# Altium schematic sheet MCU.SchDoc
size A4; SheetNumber: 3; SheetTotal: 6
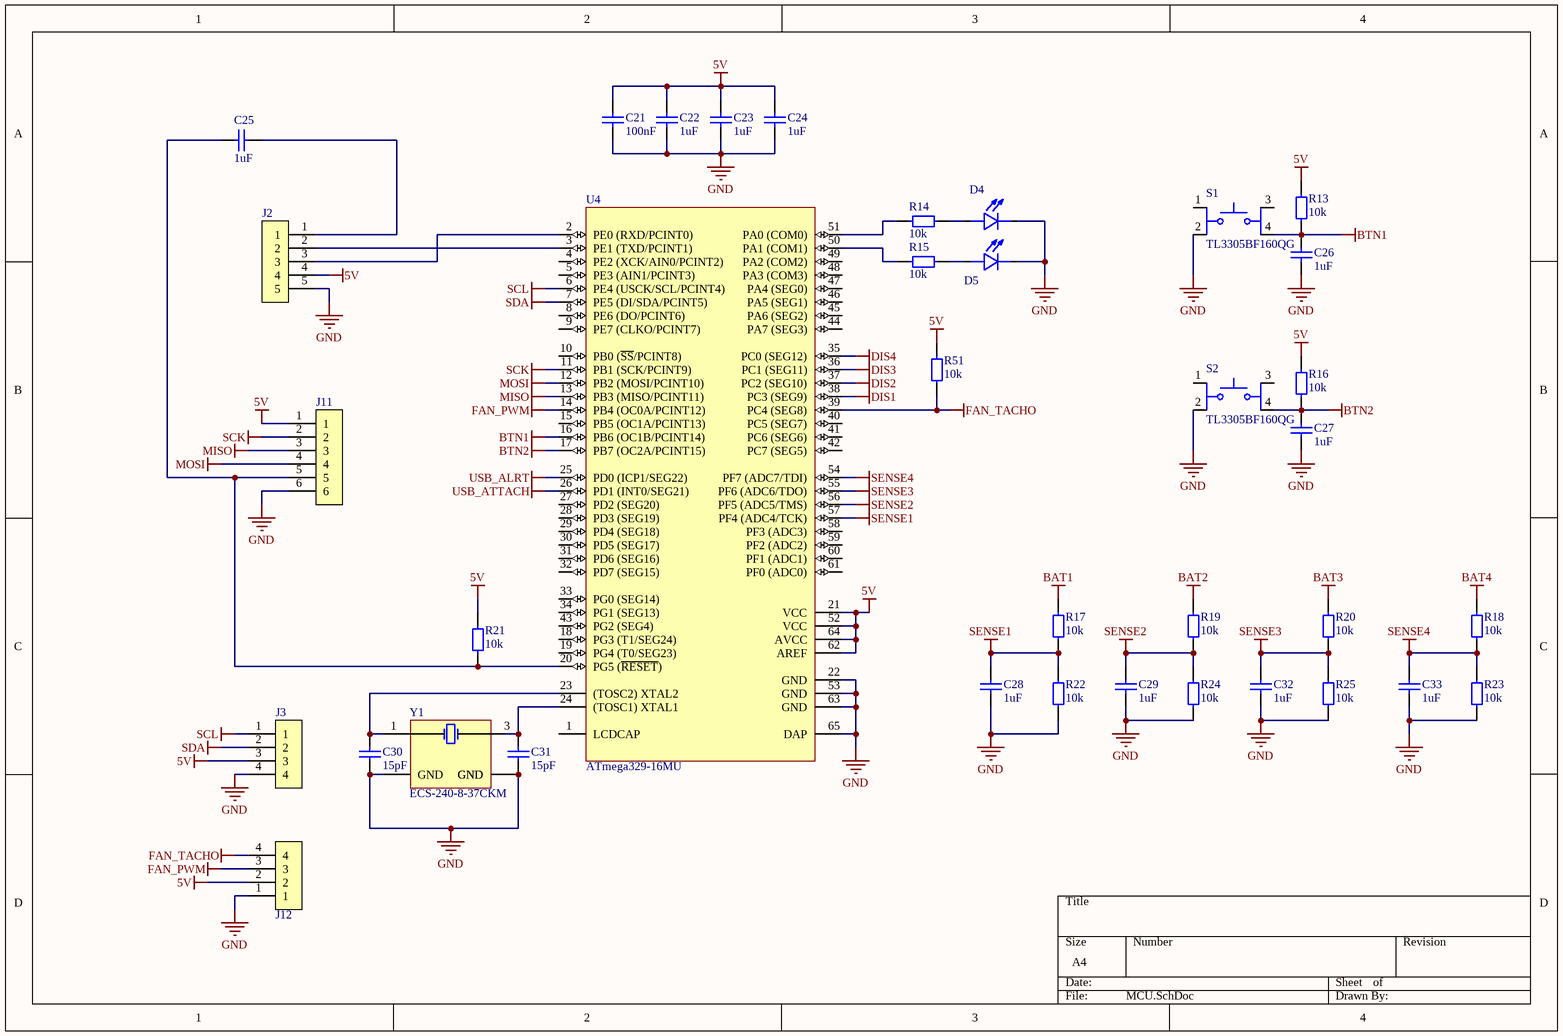
[diagram p0: MCU.SchDoc]

## Parts
C21  100nF  [0603 Capacitor]
C22  1uF  [0603 Capacitor]
C23  1uF  [0603 Capacitor]
C24  1uF  [0603 Capacitor]
C25  1uF  [0603 Capacitor]
C26  1uF  [0603 Capacitor]
C27  1uF  [0603 Capacitor]
C28  1uF  [0603 Capacitor]
C29  1uF  [0603 Capacitor]
C30  15pF  [0603 Capacitor]
C31  15pF  [0603 Capacitor]
C32  1uF  [0603 Capacitor]
C33  1uF  [0603 Capacitor]
D4  LTST-C190KGKT  [LED 0603]  (value not drawn)
D5  LTST-C190KGKT  [LED 0603]  (value not drawn)
J2  5-534237-3  [5pin header]  (value not drawn)
J3  MTSW-104-07-G-S-000  [HDRV4W64P0X254_1X4_1016X254X864P]  (value not drawn)
J11  MTSW-106-07-L-S-210  [SAMTEC_MTSW-106-23-L-S-240]  (value not drawn)
J12  MTSW-104-07-G-S-000  [HDRV4W64P0X254_1X4_1016X254X864P]  (value not drawn)
R13  10k  [0603 Resistor]
R14  10k  [0603 Resistor]
R15  10k  [0603 Resistor]
R16  10k  [0603 Resistor]
R17  10k  [0603 Resistor]
R18  10k  [0603 Resistor]
R19  10k  [0603 Resistor]
R20  10k  [0603 Resistor]
R21  10k  [0603 Resistor]
R22  10k  [0603 Resistor]
R23  10k  [0603 Resistor]
R24  10k  [0603 Resistor]
R25  10k  [0603 Resistor]
R51  10k  [0603 Resistor]
S1  TL3305BF160QG  [SW_TL3305BF160QG]
S2  TL3305BF160QG  [SW_TL3305BF160QG]
U4  ATmega329-16MU  [ATmega329]
Y1  ECS-240-8-37CKM  [XTAL_ECS-240-8-37CKM]

## Nets
5V: C21.2 C22.2 C23.2 C24.2 J2.4 J3.3 J11.1 J12.2 R13.1(CCW) R16.1(CCW) R21.1(CCW) R51.2(CW) U4.21(VCC) U4.52(VCC) U4.62(AREF) U4.64(AVCC)
BAT1: R17.1(CCW)
BAT2: R19.1(CCW)
BAT3: R20.1(CCW)
BAT4: R18.1(CCW)
BTN1: C26.2 R13.2(CW) S1.4 U4.16(PB6_(OC1B/PCINT14))
BTN2: C27.2 R16.2(CW) S2.4 U4.17(PB7_(OC2A/PCINT15))
DIS1: U4.38(PC3_(SEG9))
DIS2: U4.37(PC2_(SEG10))
DIS3: U4.36(PC1_(SEG11))
DIS4: U4.35(PC0_(SEG12))
FAN_PWM: J12.3 U4.14(PB4_(OC0A/PCINT12))
FAN_TACHO: J12.4 R51.1(CCW) U4.39(PC4_(SEG8))
GND: C21.1 C22.1 C23.1 C24.1 C26.1 C27.1 C28.1 C29.1 C30.1 C31.1 C32.1 C33.1 D4.2(C) D5.2(C) J2.5 J3.4 J11.6 J12.1 R22.2(CW) R23.2(CW) R24.2(CW) R25.2(CW) S1.2 S2.2 U4.22(GND) U4.53(GND) U4.63(GND) U4.65(DAP) Y1.2(GND) Y1.4(GND)
MISO: J11.3 U4.13(PB3_(MISO/PCINT11))
MOSI: J11.4 U4.12(PB2_(MOSI/PCINT10))
SCK: J11.2 U4.11(PB1_(SCK/PCINT9))
SCL: J3.1 U4.6(PE4_(USCK/SCL/PCINT4))
SDA: J3.2 U4.7(PE5_(DI/SDA/PCINT5))
SENSE1: C28.2 R17.2(CW) R22.1(CCW) U4.57(PF4_(ADC4/TCK))
SENSE2: C29.2 R19.2(CW) R24.1(CCW) U4.56(PF5_(ADC5/TMS))
SENSE3: C32.2 R20.2(CW) R25.1(CCW) U4.55(PF6_(ADC6/TDO))
SENSE4: C33.2 R18.2(CW) R23.1(CCW) U4.54(PF7_(ADC7/TDI))
USB_ALRT: U4.25(PD0_(ICP1/SEG22))
USB_ATTACH: U4.26(PD1_(INT0/SEG21))
NetC25_1: C25.1 J2.1
NetC25_2: C25.2 J11.5 R21.2(CW) U4.20(PG5_(~{RESET}))
NetC30_2: C30.2 U4.23((TOSC2)_XTAL2) Y1.1(X1)
NetC31_2: C31.2 U4.24((TOSC1)_XTAL1) Y1.3(X2)
NetD4_1: D4.1(A) R14.1(CCW)
NetD5_1: D5.1(A) R15.1(CCW)
NetJ2_2: J2.2 U4.3(PE1_(TXD/PCINT1))
NetJ2_3: J2.3 U4.2(PE0_(RXD/PCINT0))
NetR14_2: R14.2(CW) U4.51(PA0_(COM0))
NetR15_2: R15.2(CW) U4.50(PA1_(COM1))

Not connected (* = marked no-connect by the designer): S1 1 3; S2 1 3; U4 1(LCDCAP) 4(PE2_(XCK/AIN0/PCINT2)) 5(PE3_(AIN1/PCINT3)) 8(PE6_(DO/PCINT6)) 9(PE7_(CLKO/PCINT7)) 10(PB0_(~{SS}/PCINT8)) 15(PB5_(OC1A/PCINT13)) 18(PG3_(T1/SEG24)) 19(PG4_(T0/SEG23)) 27(PD2_(SEG20)) 28(PD3_(SEG19)) 29(PD4_(SEG18)) 30(PD5_(SEG17)) 31(PD6_(SEG16)) 32(PD7_(SEG15)) 33(PG0_(SEG14)) 34(PG1_(SEG13)) 40(PC5_(SEG7)) 41(PC6_(SEG6)) 42(PC7_(SEG5)) 43(PG2_(SEG4)) 44(PA7_(SEG3)) 45(PA6_(SEG2)) 46(PA5_(SEG1)) 47(PA4_(SEG0)) 48(PA3_(COM3)) 49(PA2_(COM2)) 58(PF3_(ADC3)) 59(PF2_(ADC2)) 60(PF1_(ADC1)) 61(PF0_(ADC0))

## Library data of the parts
C21 = Capacitor 100nF 0603: 100nF 50V 0603
C22-C29 C32 C33 = Capacitor 1uF 0603: 1uF 50V 0603
C30 C31 = Capacitor 15pF 0603: 15pF 50V 0603; MP: KAM15AR71H103MT
D4 D5 = LED 0603: 1.6x0.8mm Smd Chip Led Lamp; MF: Kingbright; MP: KPT-1608ZGC; Value: *; SnapEDA_Link: https://www.snapeda.com/parts/KPT-1608ZGC/Kingbright/view-part/?ref=snap; Availability: In Stock; Price: None; Package: 0603 Kingbright; Check_prices: https://www.snapeda.com/parts/KPT-1608ZGC/Kingbright/view-part/?ref=eda
J2 = 5pin 2.54 SAMTEC: 2.54mm; MF: {'manufacturer': 'TE Connectivity'}; MP: 534237-4; Availability: Unavailable; Package: None; Value: *; Price: None
J3 J12 = 4 pin header: CONN HEADER VERT 4POS 2.54MM; Manufacturer_Name: SAMTEC; Geometry.Height: 8.64mm; Manufacturer_Part_Number: MTSW-104-07-G-S-000; Mouser Part Number: *; Mouser Price/Stock: *; Arrow Part Number: *; Arrow Price/Stock: *; Datasheet Link: http://suddendocs.samtec.com/catalog_english/mtsw.pdf
  J12: MP: 4 pin header
J11 = 6 pin header: CONN HEADER VERT 6POS 2.54MM; Manufacturer_Name: SAMTEC; Manufacturer_Part_Number: MTSW-104-07-G-S-000; Geometry.Height: 8.64mm; MP: 4 pin header; Mouser Part Number: *; Mouser Price/Stock: *; Arrow Part Number: *; Arrow Price/Stock: *; Datasheet Link: http://suddendocs.samtec.com/catalog_english/mtsw.pdf
R13-R25 R51 = Resistor 10k 0603: 10k 0603
S1 S2 = TL3305BF160QG: Tactile Switch SPST-NO Top Actuated Surface Mount; MF: E-Switch; SnapEDA_Link: https://www.snapeda.com/parts/TL3305BF160QG/E-Switch/view-part/?ref=snap; Package: None; MP: TL3305BF160QG; Check_prices: https://www.snapeda.com/parts/TL3305BF160QG/E-Switch/view-part/?ref=eda; Purchase-URL: https://pricing.snapeda.com/search/part/TL3305BF160QG/?ref=eda; Price: None; Value: *; Availability: In Stock
U4 = ATmega329-16MU: 8-bit AVR Microcontroller, 2.7-5.5V, 32KB Flash, 1KB EEPROM, 2KB SRAM, 64-pin MLF, Industrial Grade (-40°C to 85°C); ComponentLink3Description: ATmega329/3290/649/6490 Summary; PackageDescription: 64-Pin Micro Lead Frame Package (MLF), 9 x 9 x 1.0 mm Body, 0.5 mm Pitch, 5.40 mm Exposed Pad; RevisionNote: DatasheetVersion & PackageVersion updated. URLs added.; ComponentLink1URL: http://www.atmel.com/; ComponentLink2URL: http://www.atmel.com/dyn/resources/prod_documents/doc2552.pdf; DatasheetVersion: revK, Apr-2011; ComponentLink2Description: ATmega329/3290/649/6490 Datasheet; Code_JEDEC: MO-220-VMMD; ComponentLink1Description: Manufacturer URL; PackageReference: 64M1; PackageVersion: revH, Oct-2010; ComponentLink3URL: http://www.atmel.com/dyn/resources/prod_documents/2552S.pdf
Y1 = ECS-240-8-37CKM: Output Current: 3 mA; Case\Package: SOT-553-6; Min Supply Voltage (DC): 4 V; Max Supply Voltage: 3.3 V; Min Supply Voltage: 1.4 V; Interface: I2C; Max Supply Voltage (DC): 6 V; ComponentLink2Description: Datasheet; REACH SVHC: No SVHC; ComponentLink1URL: http://www.foxonline.com/; ComponentLink2URL: http://foxonline.com/pdfs/hc49sdlf.pdf; Pins: 6; Packaging: Cut Tape; ComponentLink1Description: Manufacturer URL; Weight: 9.9E-05 oz; Length: 1.6 mm; RoHSCompliant: true; Min Operating Temperature: -55 degC; Radiation Hardening: No; PackageDescription: 2-Pin Surface Mount Device, Body 5 x 11.7 mm, Height 4.5 mm; Package Quantity: 1; Width: 1.2 mm; DatasheetVersion: Mar-15; Max Operating Temperature: 150 degC; Mount: Surface Mount; PackageReference: FOX-FOXSDLF160-20; Height: 0.55 mm